# Altium schematic sheet ASBB_GiantGecko.SchDoc
size A4
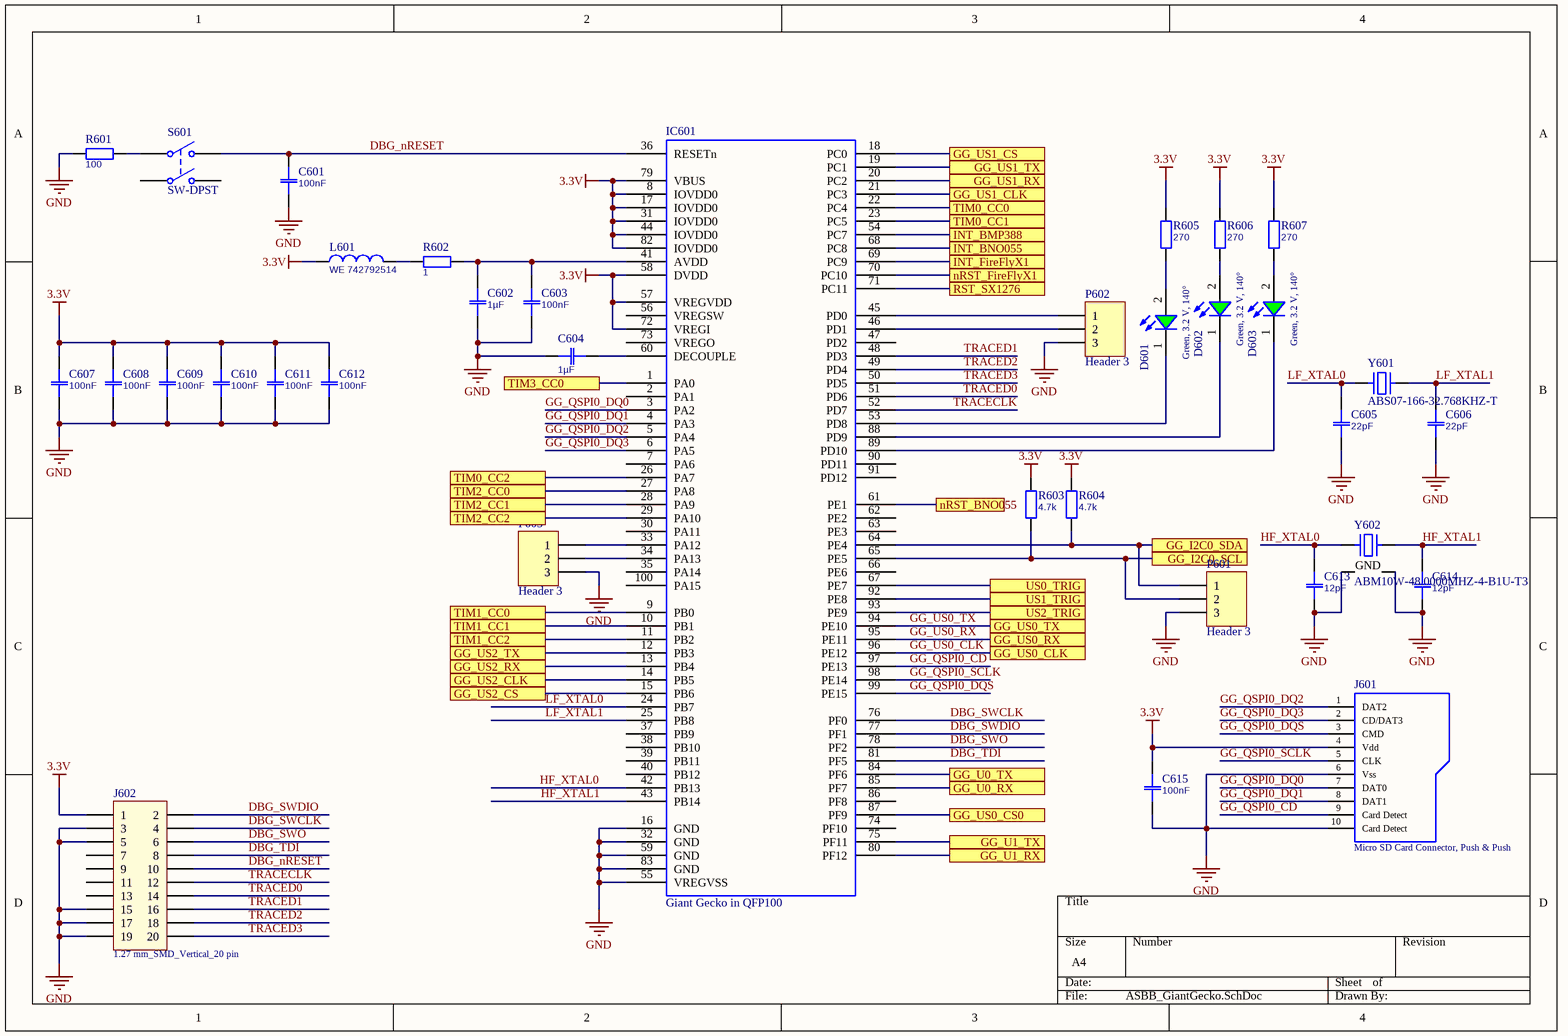
[diagram p0: ASBB_GiantGecko.SchDoc]

## Parts
C601  100nF  [0603]
C602  1µF  [0603]
C603  100nF  [0603]
C604  1µF  [0603]
C605  22pF  [0603]
C606  22pF  [0603]
C607  100nF  [0603]
C608  100nF  [0603]
C609  100nF  [0603]
C610  100nF  [0603]
C611  100nF  [0603]
C612  100nF  [0603]
C613  12pF  [0603]
C614  12pF  [0603]
C615  100nF  [0603]
D601  Green, 3.2 V, 140°  [WL-SMCW_0603]
D602  Green, 3.2 V, 140°  [WL-SMCW_0603]
D603  Green, 3.2 V, 140°  [WL-SMCW_0603]
IC601  Giant Gecko in QFP100  [TQFP100]
J601  Micro SD Card Connector, Push & Push  [693071010811]
J602  1.27 mm_SMD_Vertical_20 pin  [62102021021]
L601  WE 742792514  [1812]
P601  Header 3  [HDR1X3]
P602  Header 3  [HDR1X3]
P603  Header 3  [HDR1X3]
R601  100  [0603]
R602  1  [0603]
R603  4.7k  [0603]
R604  4.7k  [0603]
R605  270  [0603]
R606  270  [0603]
R607  270  [0603]
S601  SW-DPST  [DPST-4]
Y601  ABS07-166-32.768KHZ-T  [ABRACON ABS07]
Y602  ABM10W-48.0000MHZ-4-B1U-T3  [ABRACON ABM10]

## Ports
GG_I2C0_SCL, GG_I2C0_SDA, GG_U0_RX, GG_U0_TX, GG_U1_RX, GG_U1_TX, GG_US0_CLK, GG_US0_CS0, GG_US0_RX, GG_US0_TX, GG_US1_CLK, GG_US1_CS, GG_US1_RX, GG_US1_TX, GG_US2_CLK, GG_US2_CS, GG_US2_RX, GG_US2_TX, INT_BMP388, INT_BNO055, INT_FireFlyX1, nRST_BNO055, nRST_FireFlyX1, RST_SX1276, TIM0_CC0, TIM0_CC1, TIM0_CC2, TIM1_CC0, TIM1_CC1, TIM1_CC2, TIM2_CC0, TIM2_CC1, TIM2_CC2, TIM3_CC0, US0_TRIG, US1_TRIG, US2_TRIG

## Nets
3.3V: C607.1 C608.1 C609.1 C610.1 C611.1 C612.1 C615.1 IC601.8(IOVDD0) IC601.17(IOVDD0) IC601.31(IOVDD0) IC601.44(IOVDD0) IC601.57(VREGVDD) IC601.58(DVDD) IC601.72(VREGI) IC601.79(VBUS) IC601.82(IOVDD0) J601.4(Vdd) J602.1 L601.1 R603.2 R604.2 R605.2 R606.2 R607.2
GND: C601.2 C602.2 C603.2 C604.1 C605.2 C606.2 C607.2 C608.2 C609.2 C610.2 C611.2 C612.2 C613.2 C614.2 C615.2 IC601.16(GND) IC601.32(GND) IC601.55(VREGVSS) IC601.59(GND) IC601.83(GND) J601.6(Vss) J601.10(Card_Detect) J602.3 J602.5 J602.15 J602.17 J602.19 P601.3 P602.3 P603.3 R601.1 Y602.2(GND) Y602.4(GND)
DBG_nRESET: C601.1 IC601.36(RESETn) J602.10 S601.2(NO1)
DBG_SWCLK: IC601.76(PF0) J602.4
DBG_SWDIO: IC601.77(PF1) J602.2
DBG_SWO: IC601.78(PF2) J602.6
DBG_TDI: IC601.81(PF5) J602.8
GG_I2C0_SCL: IC601.65(PE5) P601.2 R603.1 ; port GG_I2C0_SCL
GG_I2C0_SDA: IC601.64(PE4) P601.1 R604.1 ; port GG_I2C0_SDA
GG_QSPI0_CD: IC601.97(PE13) J601.9(Card_Detect)
GG_QSPI0_DQ0: IC601.3(PA2) J601.7(DAT0)
GG_QSPI0_DQ1: IC601.4(PA3) J601.8(DAT1)
GG_QSPI0_DQ2: IC601.5(PA4) J601.1(DAT2)
GG_QSPI0_DQ3: IC601.6(PA5) J601.2(CD/DAT3)
GG_QSPI0_DQS: IC601.99(PE15) J601.3(CMD)
GG_QSPI0_SCLK: IC601.98(PE14) J601.5(CLK)
GG_U0_RX: IC601.85(PF7) ; port GG_U0_RX
GG_U0_TX: IC601.84(PF6) ; port GG_U0_TX
GG_U1_RX: IC601.80(PF12) ; port GG_U1_RX
GG_U1_TX: IC601.75(PF11) ; port GG_U1_TX
GG_US0_CLK: IC601.96(PE12) ; port GG_US0_CLK
GG_US0_CS0: IC601.87(PF9) ; port GG_US0_CS0
GG_US0_RX: IC601.95(PE11) ; port GG_US0_RX
GG_US0_TX: IC601.94(PE10) ; port GG_US0_TX
GG_US1_CLK: IC601.21(PC3) ; port GG_US1_CLK
GG_US1_CS: IC601.18(PC0) ; port GG_US1_CS
GG_US1_RX: IC601.20(PC2) ; port GG_US1_RX
GG_US1_TX: IC601.19(PC1) ; port GG_US1_TX
GG_US2_CLK: IC601.14(PB5) ; port GG_US2_CLK
GG_US2_CS: IC601.15(PB6) ; port GG_US2_CS
GG_US2_RX: IC601.13(PB4) ; port GG_US2_RX
GG_US2_TX: IC601.12(PB3) ; port GG_US2_TX
HF_XTAL0: C613.1 IC601.42(PB13) Y602.1
HF_XTAL1: C614.1 IC601.43(PB14) Y602.3
INT_BMP388: IC601.54(PC7) ; port INT_BMP388
INT_BNO055: IC601.68(PC8) ; port INT_BNO055
INT_FireFlyX1: IC601.69(PC9) ; port INT_FireFlyX1
LF_XTAL0: C605.1 IC601.24(PB7) Y601.1
LF_XTAL1: C606.1 IC601.25(PB8) Y601.2
nRST_BNO055: IC601.61(PE1) ; port nRST_BNO055
nRST_FireFlyX1: IC601.70(PC10) ; port nRST_FireFlyX1
RST_SX1276: IC601.71(PC11) ; port RST_SX1276
TIM0_CC0: IC601.22(PC4) ; port TIM0_CC0
TIM0_CC1: IC601.23(PC5) ; port TIM0_CC1
TIM0_CC2: IC601.26(PA7) ; port TIM0_CC2
TIM1_CC0: IC601.9(PB0) ; port TIM1_CC0
TIM1_CC1: IC601.10(PB1) ; port TIM1_CC1
TIM1_CC2: IC601.11(PB2) ; port TIM1_CC2
TIM2_CC0: IC601.27(PA8) ; port TIM2_CC0
TIM2_CC1: IC601.28(PA9) ; port TIM2_CC1
TIM2_CC2: IC601.29(PA10) ; port TIM2_CC2
TIM3_CC0: IC601.1(PA0) ; port TIM3_CC0
TRACECLK: IC601.52(PD7) J602.12
TRACED0: IC601.51(PD6) J602.14
TRACED1: IC601.48(PD3) J602.16
TRACED2: IC601.49(PD4) J602.18
TRACED3: IC601.50(PD5) J602.20
US0_TRIG: IC601.67(PE7) ; port US0_TRIG
US1_TRIG: IC601.92(PE8) ; port US1_TRIG
US2_TRIG: IC601.93(PE9) ; port US2_TRIG
NetC602_1: C602.1 C603.1 IC601.41(AVDD) R602.2
NetC604_2: C604.2 IC601.60(DECOUPLE)
NetD601_1: D601.1(K) IC601.53(PD8)
NetD601_2: D601.2(A) R605.1
NetD602_1: D602.1(K) IC601.88(PD9)
NetD602_2: D602.2(A) R606.1
NetD603_1: D603.1(K) IC601.89(PD10)
NetD603_2: D603.2(A) R607.1
NetIC601_33: IC601.33(PA12) P603.1
NetIC601_34: IC601.34(PA13) P603.2
NetIC601_45: IC601.45(PD0) P602.1
NetIC601_46: IC601.46(PD1) P602.2
NetL601_2: L601.2 R602.1
NetR601_2: R601.2 S601.1(COMMON1)

Not connected (* = marked no-connect by the designer): IC601 2(PA1) 7(PA6) 30(PA11) 35(PA14) 37(PB9) 38(PB10) 39(PB11) 40(PB12) 47(PD2) 56(VREGSW) 62(PE2) 63(PE3) 66(PE6) 73(VREGO) 74(PF10) 86(PF8) 90(PD11) 91(PD12) 100(PA15); J602 7 9 11 13; S601 3(COMMON2) 4(NO2)

## Library data of the parts
C601-C615 = Capacitor: Partnumber: ?; Value: ?
D601-D603 = 150060GS75000: WL-SMCW SMD Mono-color Chip LED Waterclear, size 0603, Green, 3.2 V, 140°; Forward Voltage: 3.2 V; Peak Wavelength: 515 nm; Dominant Wavelength: 525 nm; Luminous Intensity: 430 mcd; ComponentLink1Description: Manufacturer; ComponentLink1URL: http://www.we-online.de; ComponentLink2Description: Datasheet; ComponentLink2URL: http://katalog.we-online.de/led/datasheet/150060GS75000.pdf; Part Number: 150060GS75000; Published Date: May 2018; Publisher: Wurth Elektronik; Size: 0603; Viewing Angle: 140°; Operating Temperature: -40 to 85 degC; Emitting Color: Green; Mounting Technology: SMT
IC601 = EFM32GG11B8xx
J601 = 693071010811: WR-CRD Micro SD Card Connector, Push & Push, with card detection; Rated Current: 0.5A; Working Voltage: 500V AC; ComponentLink1Description: Manufacturer; ComponentLink1URL: http://www.we-online.de; ComponentLink2Description: Datasheet; ComponentLink2URL: http://katalog.we-online.de/em/datasheet/693071010811.pdf; Part Number: 693071010811; Published Date: Feb. 2018; Publisher: Wurth Elektronik; Operating Temperature: -25 to 85 degC; Mounting Technology: SMT
J602 = 62102021021: Pin Header WR-PHD, pitch 1.27 mm, SMD, Vertical, dual row, 20 pin; Rated Current: 1 A; Pin Number: 20; Pitch: 1.27 mm; Working Voltage: 100 VAC; Contact Resistance: 20 mOhm; Insulation Resistance: >1000 MOhm; ComponentLink1Description: Manufacturer; ComponentLink1URL: http://www.we-online.de; ComponentLink2Description: Datasheet; ComponentLink2URL: http://katalog.we-online.de/em/datasheet/62102021021.pdf; Part Number: 62102021021; Published Date: Jan. 2018; Publisher: Wurth Elektronik; Operating Temperature: -40 to 105 degC; Mounting Technology: SMD; Row Number: Dual; Orientation: Vertical
L601 = Inductor: Partnumber: ?; Value: ?
P601-P603 = Header 3: Header, 3-Pin; LatestRevisionDate: 17-Jul-2002; LatestRevisionNote: Re-released for DXP Platform.; Publisher: Altium Limited
R601-R607 = Resistor: Partnumber: ?; Value: ?
S601 = SW-DPST: Double-Pole, Single-Throw Switch; Published: 24-Mar-1999; LatestRevisionDate: 17-Jul-2002; LatestRevisionNote: Re-released for DXP Platform.; PackageReference: DPST-4; Publisher: Altium Limited; PackageDescription: Switch; 4 Leads
Y601 = Abracon Crystal ABS06: SMT Crystal
Y602 = Abracon Crystal ABM10: SMT Crystal